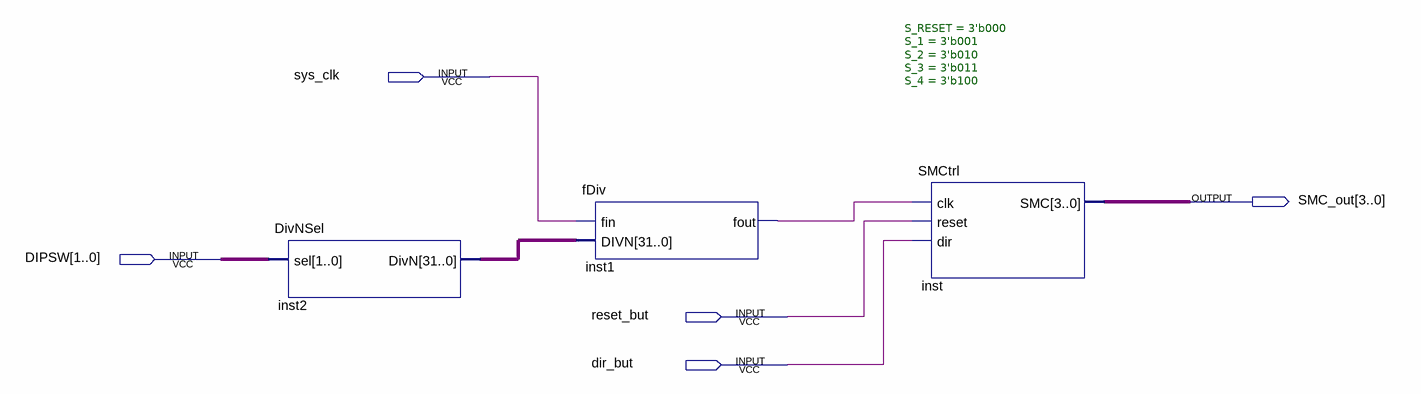
[diagram p0: schematic sheet]
// Quartus schematic EE_lab2.bdf as structural Verilog: 3 symbols, 5 pins
module EE_lab2 (
  input  sys_clk,
  input  [1:0] DIPSW,
  input  reset_but,
  input  dir_but,
  output [3:0] SMC_out
);

  wire inst1_fout;
  wire [31:0] inst2_divn;

  DivNSel inst2 (.sel(DIPSW), .DivN(inst2_divn));
  fDiv inst1 (.fin(sys_clk), .DIVN(inst2_divn), .fout(inst1_fout));
  SMCtrl #(.S_RESET(3'b000), .S_1(3'b001), .S_2(3'b010), .S_3(3'b011), .S_4(3'b100)) inst (
    .clk(inst1_fout), .reset(reset_but), .dir(dir_but), .SMC(SMC_out));
endmodule
